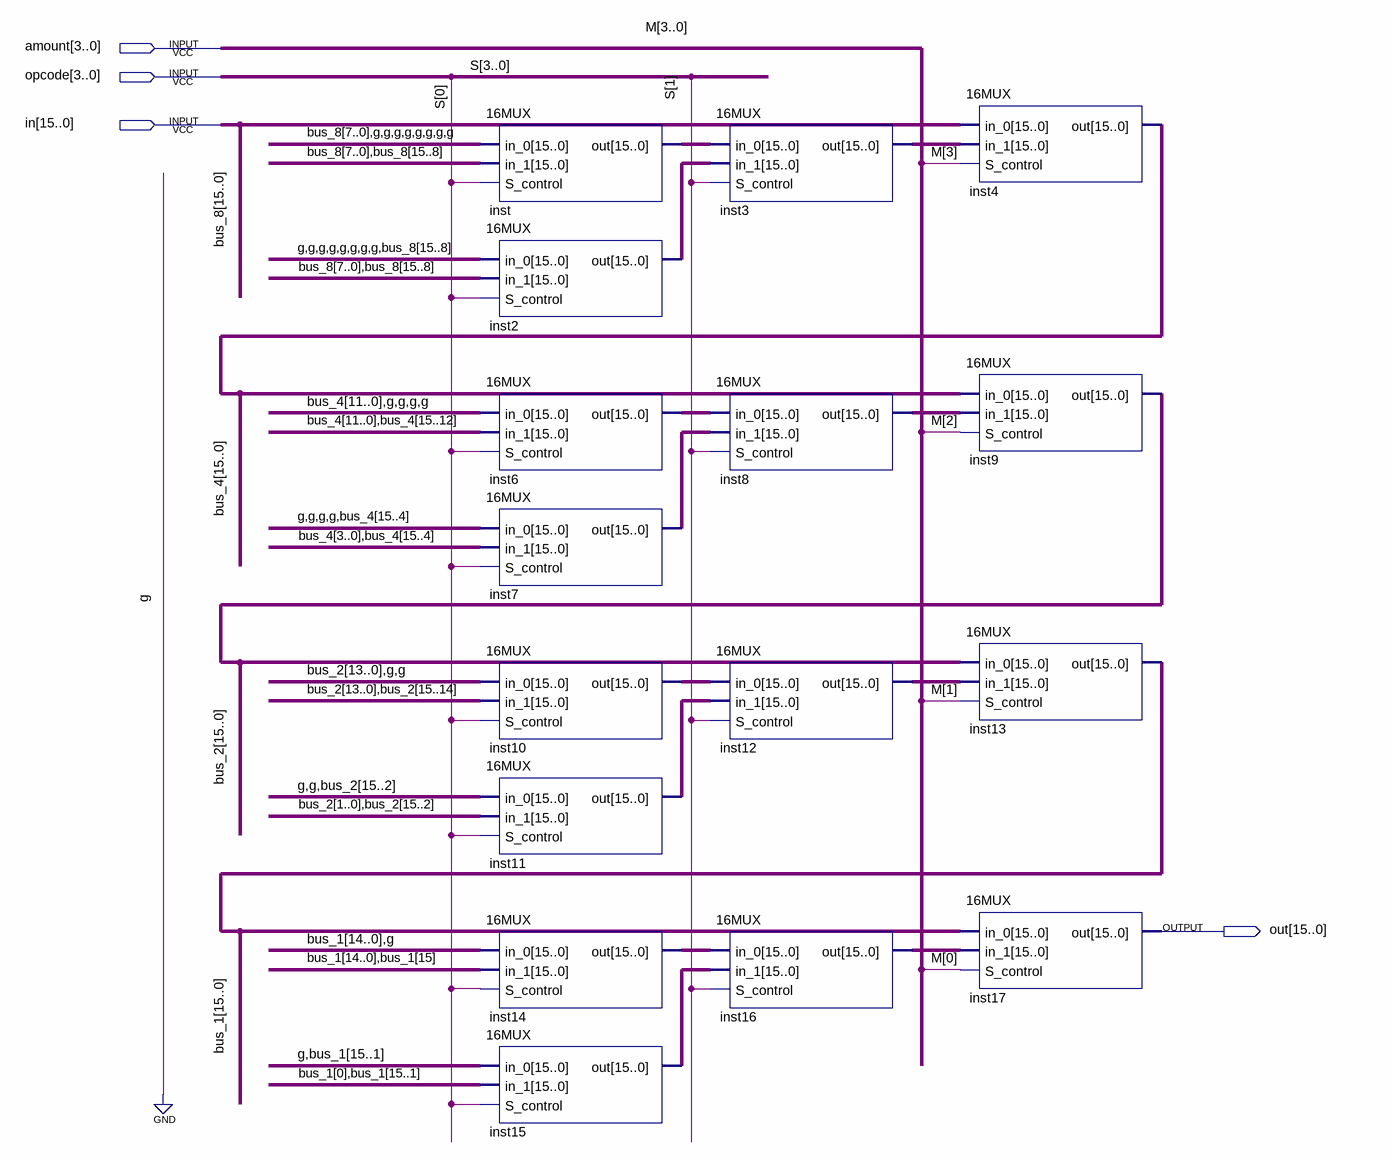
[diagram p0: schematic sheet]
// Quartus schematic shifter.bdf as structural Verilog: 16 symbols, 4 pins
module shifter (
  input  [3:0] amount,
  input  [3:0] opcode,
  input  [15:0] in,
  output [15:0] out
);

  wire [15:0] bus_1, bus_2, bus_4, inst2_out, inst3_out, inst6_out, inst7_out, inst8_out, inst10_out,
       inst11_out, inst12_out, inst14_out, inst15_out, inst16_out, inst_out;

  \16MUX  inst (.in_0({in[7:0], {8{1'b0}}}), .in_1({in[7:0], in[15:8]}), .S_control(opcode[0]), .out(inst_out));
  \16MUX  inst2 (.in_0({{8{1'b0}}, in[15:8]}), .in_1({in[7:0], in[15:8]}), .S_control(opcode[0]), .out(inst2_out));
  \16MUX  inst6 (
    .in_0({bus_4[11:0], 4'b0000}), .in_1({bus_4[11:0], bus_4[15:12]}), .S_control(opcode[0]), .out(inst6_out));
  \16MUX  inst7 (
    .in_0({4'b0000, bus_4[15:4]}), .in_1({bus_4[3:0], bus_4[15:4]}), .S_control(opcode[0]), .out(inst7_out));
  \16MUX  inst10 (
    .in_0({bus_2[13:0], 2'b00}), .in_1({bus_2[13:0], bus_2[15:14]}), .S_control(opcode[0]), .out(inst10_out));
  \16MUX  inst11 (
    .in_0({2'b00, bus_2[15:2]}), .in_1({bus_2[1:0], bus_2[15:2]}), .S_control(opcode[0]), .out(inst11_out));
  \16MUX  inst14 (.in_0({bus_1[14:0], 1'b0}), .in_1({bus_1[14:0], bus_1[15]}), .S_control(opcode[0]), .out(inst14_out));
  \16MUX  inst15 (.in_0({1'b0, bus_1[15:1]}), .in_1({bus_1[0], bus_1[15:1]}), .S_control(opcode[0]), .out(inst15_out));
  \16MUX  inst3 (.in_0(inst_out), .in_1(inst2_out), .S_control(opcode[1]), .out(inst3_out));
  \16MUX  inst8 (.in_0(inst6_out), .in_1(inst7_out), .S_control(opcode[1]), .out(inst8_out));
  \16MUX  inst12 (.in_0(inst10_out), .in_1(inst11_out), .S_control(opcode[1]), .out(inst12_out));
  \16MUX  inst16 (.in_0(inst14_out), .in_1(inst15_out), .S_control(opcode[1]), .out(inst16_out));
  \16MUX  inst4 (.in_0(in), .in_1(inst3_out), .S_control(amount[3]), .out(bus_4));
  \16MUX  inst9 (.in_0(bus_4), .in_1(inst8_out), .S_control(amount[2]), .out(bus_2));
  \16MUX  inst13 (.in_0(bus_2), .in_1(inst12_out), .S_control(amount[1]), .out(bus_1));
  \16MUX  inst17 (.in_0(bus_1), .in_1(inst16_out), .S_control(amount[0]), .out(out));

  // Other names for the same wires on the sheet: bus_8[15:0] = in; M[3:0] = amount; S[3:0] = opcode
endmodule
